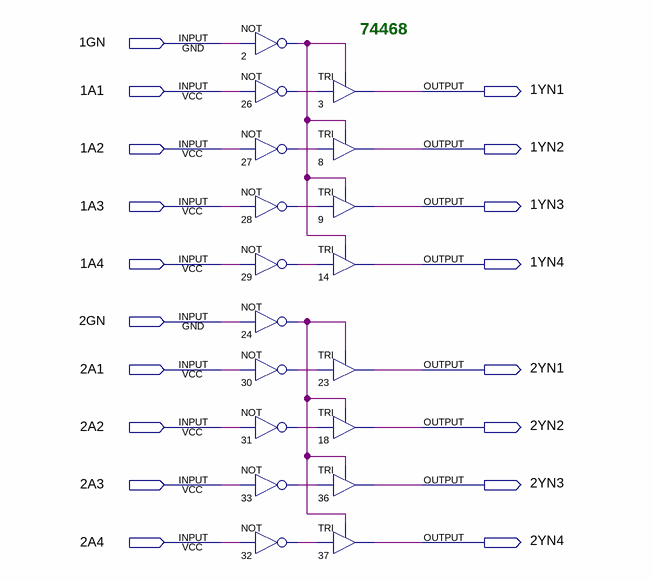
[diagram p0: schematic sheet]
// Quartus schematic 74468.bdf as structural Verilog: 18 symbols, 18 pins
module \74468  (
  input  \1GN ,
  input  \1A1 ,
  input  \1A2 ,
  input  \1A3 ,
  input  \1A4 ,
  input  \2GN ,
  input  \2A1 ,
  input  \2A2 ,
  input  \2A3 ,
  input  \2A4 ,
  output \1YN1 ,
  output \1YN2 ,
  output \1YN3 ,
  output \1YN4 ,
  output \2YN1 ,
  output \2YN2 ,
  output \2YN3 ,
  output \2YN4 
);

  wire n2_out, n24_out, n26_out, n27_out, n28_out, n29_out, n30_out, n31_out, n32_out, n33_out;

  not u_2 (n2_out, \1GN );
  not u_26 (n26_out, \1A1 );
  not u_27 (n27_out, \1A2 );
  not u_28 (n28_out, \1A3 );
  not u_29 (n29_out, \1A4 );
  not u_24 (n24_out, \2GN );
  not u_30 (n30_out, \2A1 );
  not u_31 (n31_out, \2A2 );
  not u_33 (n33_out, \2A3 );
  not u_32 (n32_out, \2A4 );
  TRI u_3 (.IN(n26_out), .OE(n2_out), .OUT(\1YN1 ));
  TRI u_8 (.IN(n27_out), .OE(n2_out), .OUT(\1YN2 ));
  TRI u_9 (.IN(n28_out), .OE(n2_out), .OUT(\1YN3 ));
  TRI u_14 (.IN(n29_out), .OE(n2_out), .OUT(\1YN4 ));
  TRI u_23 (.IN(n30_out), .OE(n24_out), .OUT(\2YN1 ));
  TRI u_18 (.IN(n31_out), .OE(n24_out), .OUT(\2YN2 ));
  TRI u_36 (.IN(n33_out), .OE(n24_out), .OUT(\2YN3 ));
  TRI u_37 (.IN(n32_out), .OE(n24_out), .OUT(\2YN4 ));

  // Notes on the sheet:
  //   74468
endmodule
